# EAGLE design lcd-2x20 (EAGLE 5.11)
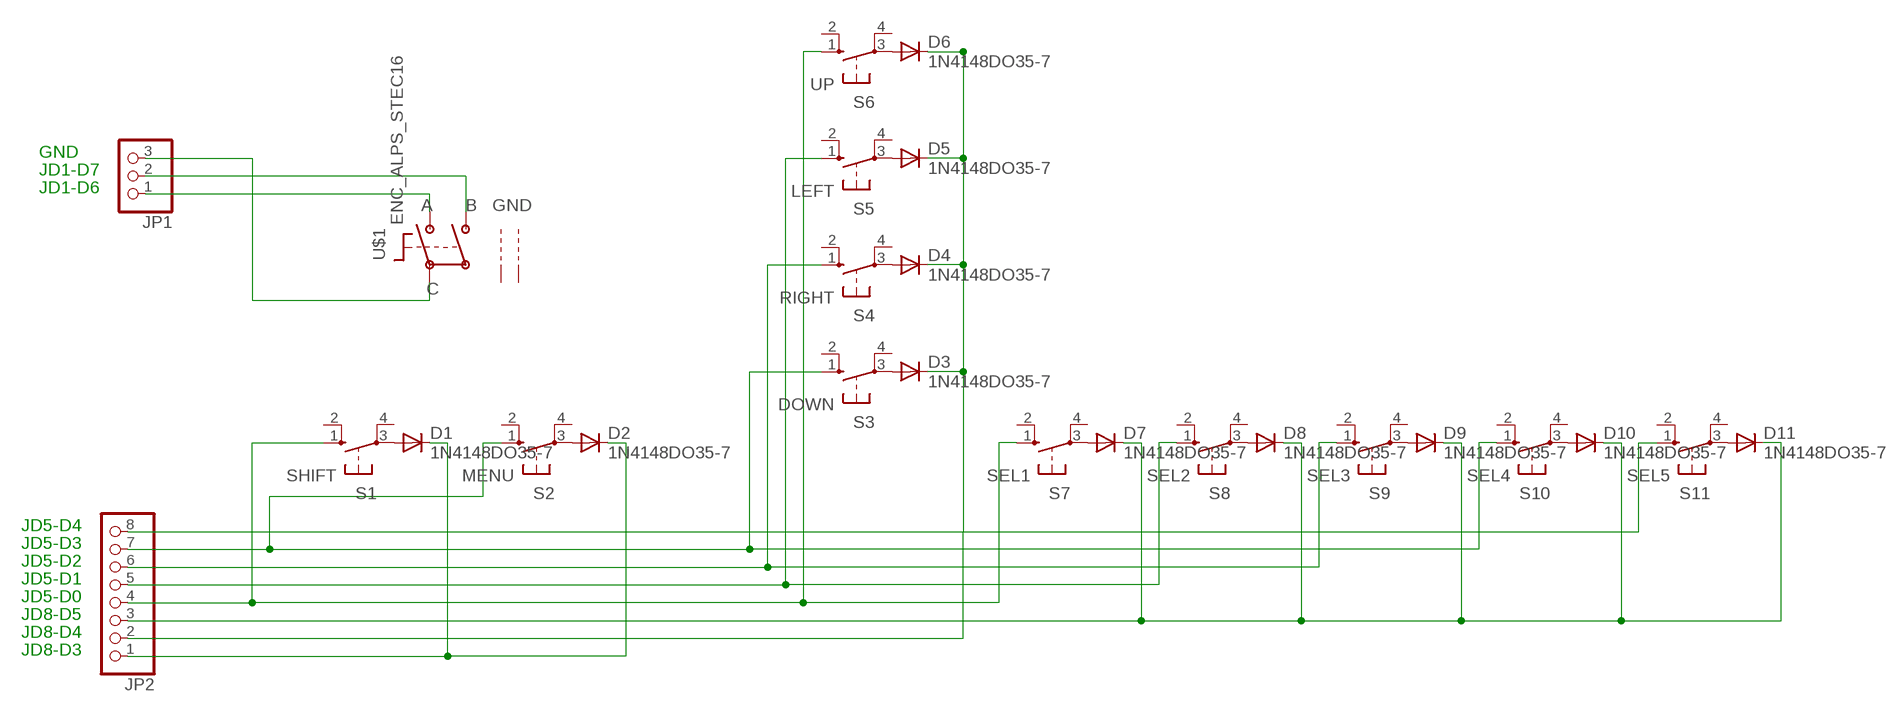
[diagram p0: schematic, sheet 1]

## Parts
D1  1N4148DO35-7  DIODE-DO214AC  [DO214AC]
D2  1N4148DO35-7  DIODE-DO214AC  [DO214AC]
D3  1N4148DO35-7  DIODE-DO214AC  [DO214AC]
D4  1N4148DO35-7  DIODE-DO214AC  [DO214AC]
D5  1N4148DO35-7  DIODE-DO214AC  [DO214AC]
D6  1N4148DO35-7  DIODE-DO214AC  [DO214AC]
D7  1N4148DO35-7  DIODE-DO214AC  [DO214AC]
D8  1N4148DO35-7  DIODE-DO214AC  [DO214AC]
D9  1N4148DO35-7  DIODE-DO214AC  [DO214AC]
D10  1N4148DO35-7  DIODE-DO214AC  [DO214AC]
D11  1N4148DO35-7  DIODE-DO214AC  [DO214AC]
JP1  PINHD-1X3  [1X03]
JP2  PINHD-1X8  [1X08]
S1  SHIFT  10-XX  [B3F-10XX]
S2  MENU  10-XX  [B3F-10XX]
S3  DOWN  10-XX  [B3F-10XX]
S4  RIGHT  10-XX  [B3F-10XX]
S5  LEFT  10-XX  [B3F-10XX]
S6  UP  10-XX  [B3F-10XX]
S7  SEL1  10-XX  [B3F-10XX]
S8  SEL2  10-XX  [B3F-10XX]
S9  SEL3  10-XX  [B3F-10XX]
S10  SEL4  10-XX  [B3F-10XX]
S11  SEL5  10-XX  [B3F-10XX]
U$1  ENC_ALPS_STEC16  [STEC16]

## Nets
N$1: JP1.2 U$1.P$B
N$2: JP1.1 U$1.P$A
N$3: JP1.3 U$1.P$C
N$4: JP2.7 S2.1(S) S3.1(S) S10.1(S)
N$5: D1.A S1.3(P)
N$6: D2.A S2.3(P)
N$7: D3.A S3.3(P)
N$8: D4.A S4.3(P)
N$9: D5.A S5.3(P)
N$10: D6.A S6.3(P)
N$11: D7.A S7.3(P)
N$12: D8.A S8.3(P)
N$13: D9.A S9.3(P)
N$14: D10.A S10.3(P)
N$15: D11.A S11.3(P)
N$16: D1.C D2.C JP2.1
N$17: JP2.4 S1.1(S) S6.1(S) S7.1(S)
N$18: D3.C D4.C D5.C D6.C JP2.2
N$19: D7.C D8.C D9.C D10.C D11.C JP2.3
N$20: JP2.5 S5.1(S) S8.1(S)
N$21: JP2.6 S4.1(S) S9.1(S)
N$22: JP2.8 S11.1(S)
Unconnected: S1.2(S1) S1.4(P1) S2.2(S1) S2.4(P1) S3.2(S1) S3.4(P1) S4.2(S1) S4.4(P1) S5.2(S1) S5.4(P1) S6.2(S1) S6.4(P1) S7.2(S1) S7.4(P1) S8.2(S1) S8.4(P1) S9.2(S1) S9.4(P1) S10.2(S1) S10.4(P1) S11.2(S1) S11.4(P1) U$1.P$GND1 U$1.P$GND2

## Notes on the sheet
- GND
- JD1-D7
- JD1-D6
- JD5-D4
- JD5-D3
- JD5-D2
- JD5-D1
- JD5-D0
- JD8-D5
- JD8-D4
- JD8-D3

## Library data of the parts
D1-D11 = diode:DIODE-: DIODE
JP1 = pinhead:PINHD-1X3: PIN HEADER
JP2 = pinhead:PINHD-1X8: PIN HEADER
S1-S11 = switch-omron:10-XX: OMRON SWITCH; MPN: B3F-1000; OC_FARNELL: 176432; OC_NEWARK: 36M3542
U$1 = encoder:ENC

## Board
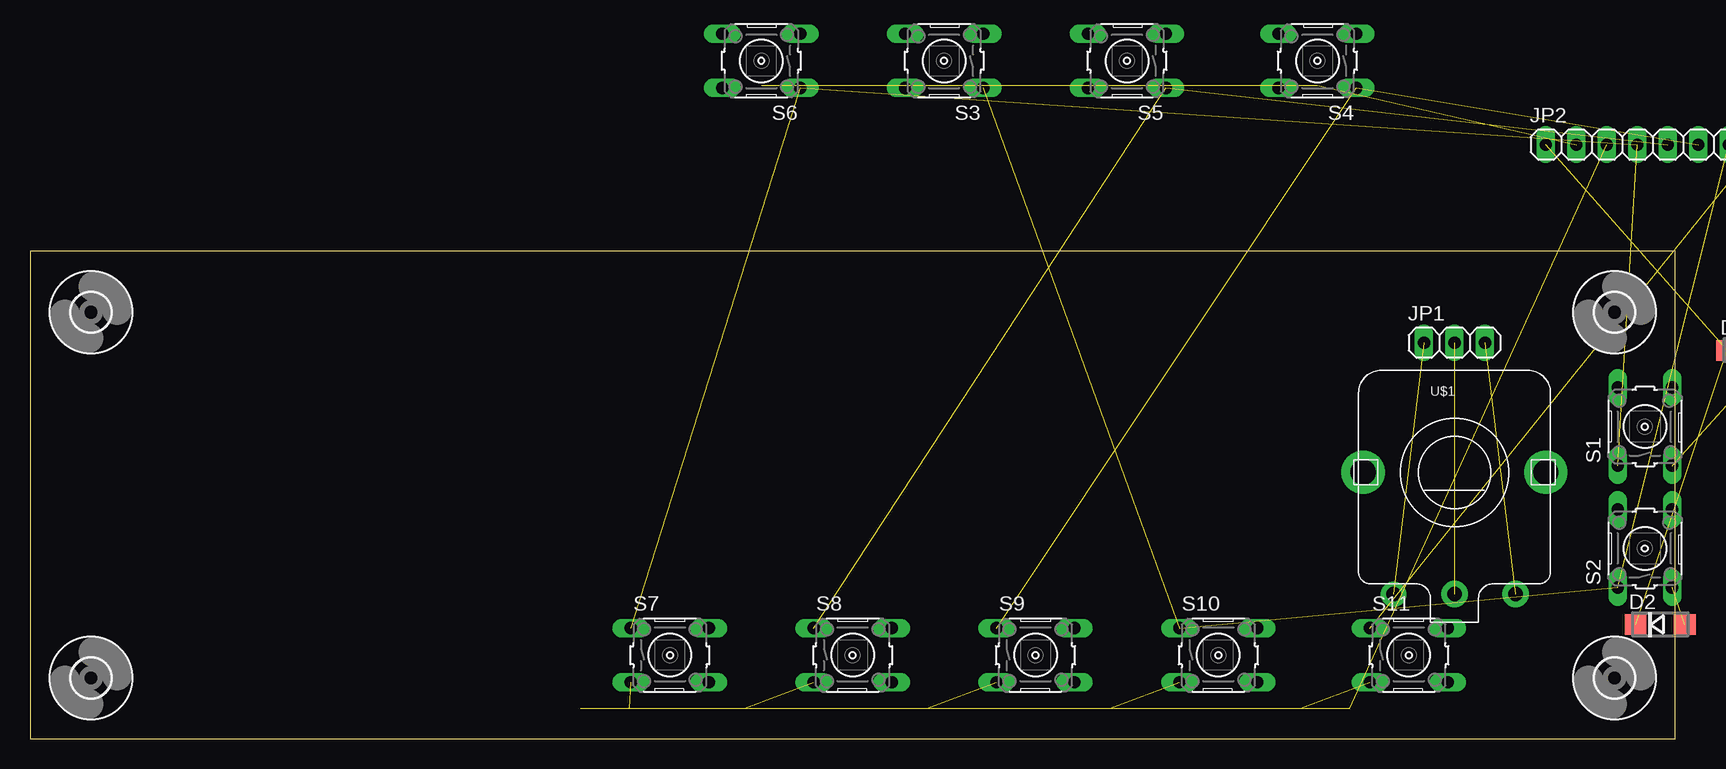
[diagram p1: board, top side]
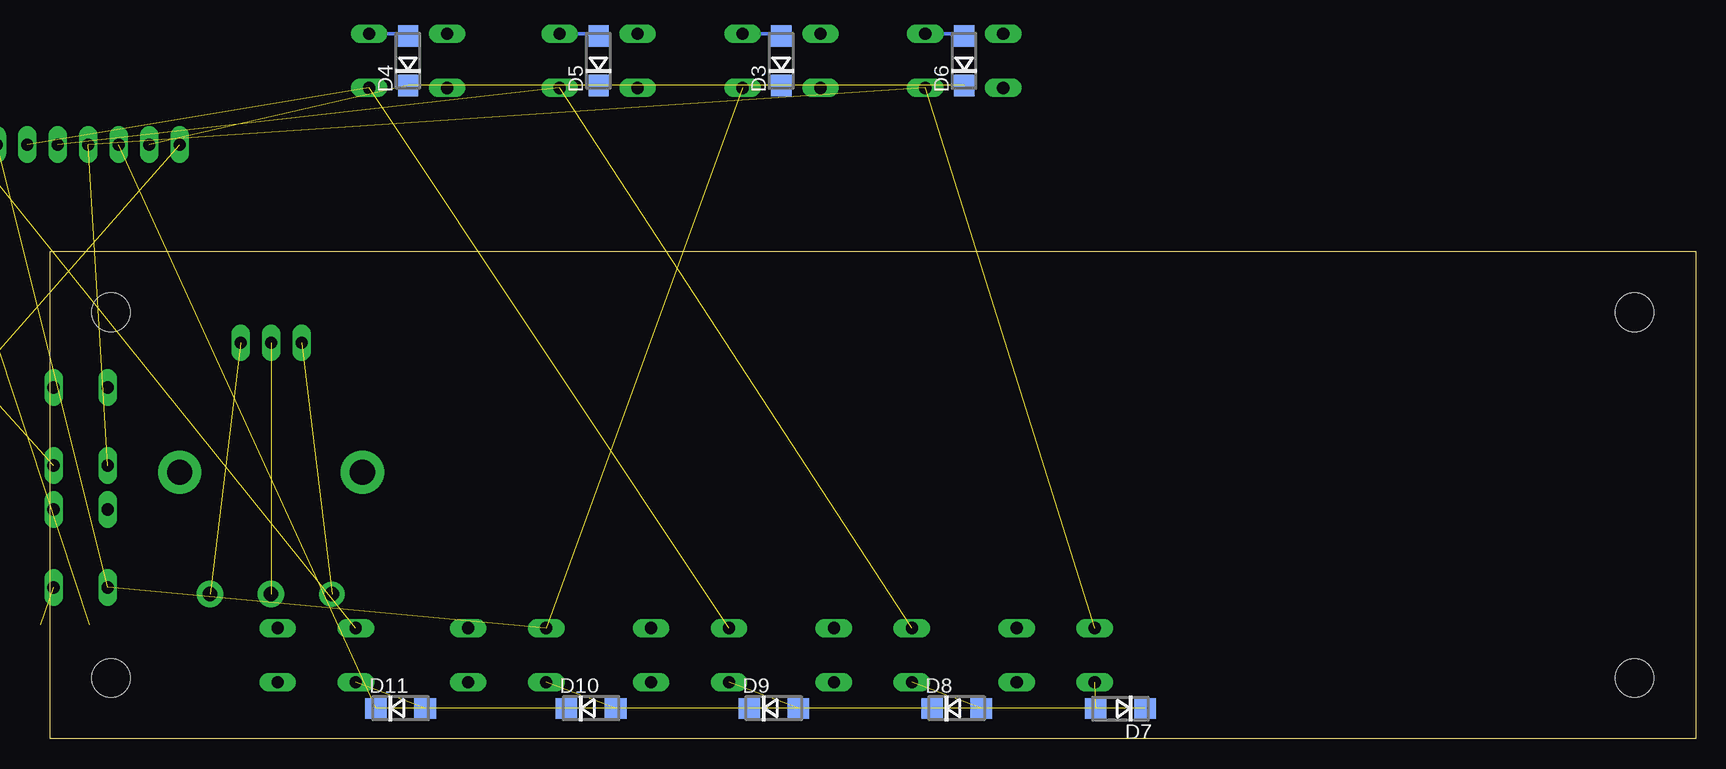
[diagram p2: board, bottom side, seen from below]

Size 137.14 x 40.63 mm. Coordinates in mm from the lower left corner, seen from the top.
Outline: 0,0 137.14,0 137.14,40.63 0,40.63 0,0
Copper layers (1*16): Top 0.035mm / dielectric 1.5mm / Bottom 0.035mm
Design rules "default *": minimum track width 10mil, minimum drill 20mil, track to track 8mil, track to pad 8mil, pad to pad 8mil, via to via 8mil, smd to smd 8mil, copper to edge 40mil, drill to drill 8mil, minimum pad ring 10mil, minimum via ring 8mil, stop-mask expansion 4mil, vias tented up to drill 0mil, thermal gap 10mil

### Footprints (pad centres in the part's own frame; a part is rotated, then mirrored left to right if it is on the bottom)
DO214AC = smd 1.8 x 1.7: A 2.05,0; C -2.05,0
1X03 = drill 1.016 long: 1 -2.54,0; 2 0,0; 3 2.54,0
1X08 = drill 1.016 long: 1 -8.89,0; 2 -6.35,0; 3 -3.81,0; 4 -1.27,0; 5 1.27,0; 6 3.81,0; 7 6.35,0; 8 8.89,0
B3F-10XX = drill 1.016 long: 1 -3.251,2.261; 2 3.251,2.261; 3 -3.251,-2.261; 4 3.251,-2.261
STEC16 = drill 1.2 pad 2.1 round: P$A -5.08,-10.16 | drill 1.2 pad 2.2 round: P$B 0,-10.16; P$C 5.08,-10.16 | drill 2.1 pad 3.6 round: P$GND1 -7.62,0; P$GND2 7.62,0
3,2 = hole 3.2: 0,0

### Placement (x,y rotation side)
D1  143.51,32.38 0 top  (outside the outline)
D2  135.89,9.53 0 top
D3  76.2,56.52 90 bottom  (outside the outline)
D4  107.31,56.52 90 bottom  (outside the outline)
D5  91.44,56.52 90 bottom  (outside the outline)
D6  60.96,56.52 90 bottom  (outside the outline)
D7  47.94,2.54 180 bottom
D8  61.59,2.54 0 bottom
D9  76.83,2.54 0 bottom
D10  92.08,2.54 0 bottom
D11  107.95,2.54 0 bottom
JP1  118.75,33.02 0 top
JP2  135.25,49.53 0 top  (outside the outline)
S1  134.62,26.04 90 top
S2  134.62,15.88 90 top
S3  76.2,56.52 180 top  (outside the outline)
S4  107.31,56.52 180 top  (outside the outline)
S5  91.44,56.52 180 top  (outside the outline)
S6  60.96,56.52 180 top  (outside the outline)
S7  53.34,6.99 0 top
S8  68.58,6.99 0 top
S9  83.82,6.99 0 top
S10  99.06,6.99 0 top
S11  114.94,6.99 0 top
U$1  118.75,22.23 0 top
U$2  [3,2]  5.08,5.08 0 top
U$3  [3,2]  5.08,35.56 0 top
U$4  [3,2]  132.08,35.56 0 top
U$5  [3,2]  132.08,5.08 0 top

### Tracks (layer width: path | path; a pad name or v marks a point on that pad's centre or on a via)
N$1  (1 unrouted)
N$2  (1 unrouted)
N$3  (1 unrouted)
N$4  (3 unrouted)
N$5  (1 unrouted)
N$6  (1 unrouted)
N$7
  Bottom 0.305: S3.3 76.41,58.78 D3.A
N$8
  Bottom 0.305: S4.3 107.53,58.78 D4.A
N$9
  Bottom 0.305: S5.3 91.65,58.78 D5.A
N$10
  Bottom 0.305: S6.3 61.17,58.78 D6.A
N$11  (1 unrouted)
N$12  (1 unrouted)
N$13  (1 unrouted)
N$14  (1 unrouted)
N$15  (1 unrouted)
N$16  (2 unrouted)
N$17  (3 unrouted)
N$18  (4 unrouted)
N$19  (5 unrouted)
N$20  (2 unrouted)
N$21  (2 unrouted)
N$22  (1 unrouted)